# EAGLE design Rev A (EAGLE 9.6.2)
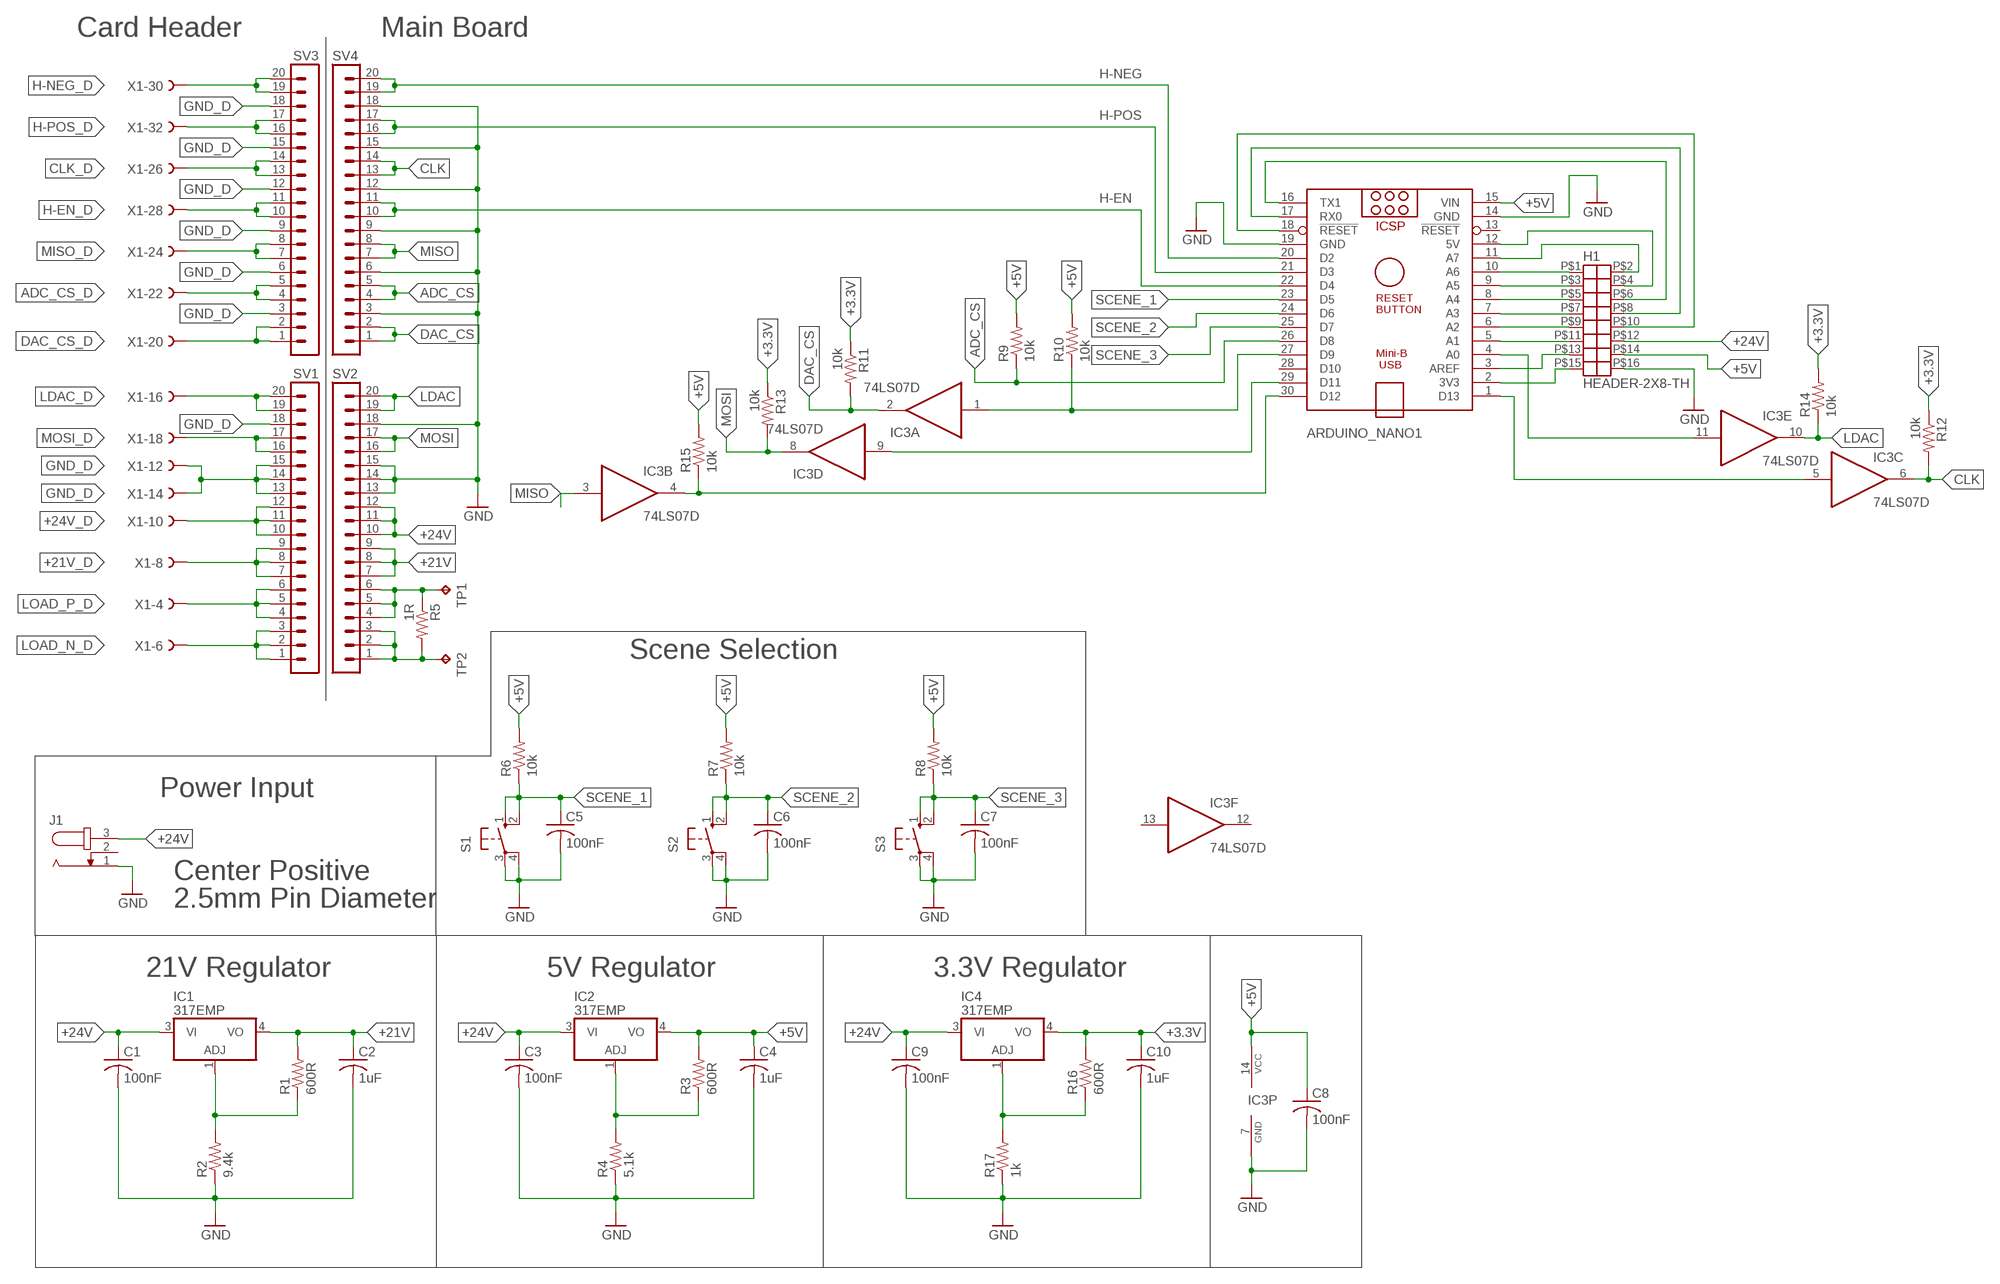
[diagram p0: schematic, sheet 1]

## Parts
ARDUINO_NANO1  ARDUINO_NANO  [ARDUINO_NANO]
C1  100nF  C-USC0603  [C0603]
C2  1uF  C-USC1206  [C1206]
C3  100nF  C-USC0603  [C0603]
C4  1uF  C-USC1206  [C1206]
C5  100nF  C-USC0603  [C0603]
C6  100nF  C-USC0603  [C0603]
C7  100nF  C-USC0603  [C0603]
C8  100nF  C-USC0603  [C0603]
C9  100nF  C-USC0603  [C0603]
C10  1uF  C-USC1206  [C1206]
H1  HEADER-2X8-TH  [HEADER-2X8-TH]
IC1  317EMP  [SOT223]
IC2  317EMP  [SOT223]
IC3  74LS07D  [SO14]
IC4  317EMP  [SOT223]
J1  JACK-PLUG1  [SPC4078]
R1  600R  R-US_R0603  [R0603]
R2  9.4k  R-US_R0603  [R0603]
R3  600R  R-US_R0603  [R0603]
R4  5.1k  R-US_R0603  [R0603]
R5  1R  R-US_R1206  [R1206]
R6  10k  R-US_R0603  [R0603]
R7  10k  R-US_R0603  [R0603]
R8  10k  R-US_R0603  [R0603]
R9  10k  R-US_R0603  [R0603]
R10  10k  R-US_R0603  [R0603]
R11  10k  R-US_R0603  [R0603]
R12  10k  R-US_R0603  [R0603]
R13  10k  R-US_R0603  [R0603]
R14  10k  R-US_R0603  [R0603]
R15  10k  R-US_R0603  [R0603]
R16  600R  R-US_R0603  [R0603]
R17  1k  R-US_R0603  [R0603]
S1  10-XX  [B3F-10XX]
S2  10-XX  [B3F-10XX]
S3  10-XX  [B3F-10XX]
SV1  MA20-1  [MA20-1]
SV2  MA20-1W  [MA20-1W]
SV3  MA20-1  [MA20-1]
SV4  MA20-1W  [MA20-1W]
TP1  TPB2,54  [B2,54]
TP2  TPB2,54  [B2,54]
X1  FH15  [FH15]

## Nets
+3.3V: C10.1 IC4.4(VO) R11.1 R12.1 R13.1 R14.2 R16.2
+5V: ARDUINO_NANO1.15(VIN) C4.1 C8.1 H1.P$14 IC2.4(VO) IC3.14(P:VCC) R3.2 R6.2 R7.2 R8.2 R9.2 R10.2 R15.2
+21V: C2.1 IC1.4(VO) R1.2 SV2.7 SV2.8 SV2.9
+21V_D: SV1.7 SV1.8 SV1.9 X1.8
+24V: C1.1 C3.1 C9.1 H1.P$12 IC1.3(VI) IC2.3(VI) IC4.3(VI) J1.3 SV2.10 SV2.11 SV2.12
+24V_D: SV1.10 SV1.11 SV1.12 X1.10
ADC_CS: ARDUINO_NANO1.26(D8) R9.1 SV4.4 SV4.5
ADC_CS_D: SV3.4 SV3.5 X1.22
CLK: IC3.6(C:O) R12.2 SV4.13 SV4.14
CLK_D: SV3.13 SV3.14 X1.26
DAC_CS: IC3.2(A:O) R11.2 SV4.1 SV4.2
DAC_CS_D: SV3.1 SV3.2 X1.20
GND: ARDUINO_NANO1.14(GND) ARDUINO_NANO1.19(GND) C1.2 C2.2 C3.2 C4.2 C5.2 C6.2 C7.2 C8.2 C9.2 C10.2 H1.P$16 IC3.7(P:GND) J1.1 R2.1 R4.1 R17.1 S1.3(P) S1.4(P1) S2.3(P) S2.4(P1) S3.3(P) S3.4(P1) SV2.13 SV2.14 SV2.15 SV2.18 SV4.3 SV4.6 SV4.9 SV4.12 SV4.15 SV4.18
GND_D: SV1.13 SV1.14 SV1.15 SV1.18 SV3.3 SV3.6 SV3.9 SV3.12 SV3.15 SV3.18 X1.12 X1.14
H-EN_D: SV3.10 SV3.11 X1.28
H-NEG_D: SV3.19 SV3.20 X1.30
H-POS_D: SV3.16 SV3.17 X1.32
LDAC: IC3.10(E:O) R14.1 SV2.19 SV2.20
LDAC_D: SV1.19 SV1.20 X1.16
LOAD_N_D: SV1.1 SV1.2 SV1.3 X1.6
LOAD_P_D: SV1.4 SV1.5 SV1.6 X1.4
MISO: IC3.3(B:I) SV4.7 SV4.8
MISO_D: SV3.7 SV3.8 X1.24
MOSI: IC3.8(D:O) R13.2 SV2.16 SV2.17
MOSI_D: SV1.16 SV1.17 X1.18
N$1: IC2.1(ADJ) R3.1 R4.2
N$2: IC1.1(ADJ) R1.1 R2.2
N$3: ARDUINO_NANO1.20(D2) SV4.19 SV4.20
N$4: ARDUINO_NANO1.2(3V3) H1.P$15
N$5: ARDUINO_NANO1.21(D3) SV4.16 SV4.17
N$6: ARDUINO_NANO1.3(AREF) H1.P$13
N$7: ARDUINO_NANO1.5(A1) H1.P$11
N$8: ARDUINO_NANO1.6(A2) H1.P$9
N$9: ARDUINO_NANO1.22(D4) SV4.10 SV4.11
N$10: ARDUINO_NANO1.7(A3) H1.P$7
N$11: ARDUINO_NANO1.8(A4) H1.P$5
N$12: ARDUINO_NANO1.9(A5) H1.P$3
N$13: ARDUINO_NANO1.10(A6) H1.P$1
N$14: ARDUINO_NANO1.11(A7) H1.P$2
N$15: ARDUINO_NANO1.12(5V) H1.P$4
N$16: ARDUINO_NANO1.16(TX1) H1.P$6
N$17: ARDUINO_NANO1.17(RX0) H1.P$8
N$18: ARDUINO_NANO1.18(!RESET) H1.P$10
N$19: ARDUINO_NANO1.27(D9) IC3.1(A:I) R10.1
N$20: ARDUINO_NANO1.1(D13) IC3.5(C:I)
N$21: ARDUINO_NANO1.29(D11) IC3.9(D:I)
N$22: R5.1 SV2.4 SV2.5 SV2.6 TP1.TP
N$23: R5.2 SV2.1 SV2.2 SV2.3 TP2.TP
N$24: ARDUINO_NANO1.4(A0) IC3.11(E:I)
N$25: ARDUINO_NANO1.30(D12) IC3.4(B:O) R15.1
N$26: IC4.1(ADJ) R16.1 R17.2
SCENE_1: ARDUINO_NANO1.23(D5) C5.1 R6.1 S1.1(S) S1.2(S1)
SCENE_2: ARDUINO_NANO1.24(D6) C6.1 R7.1 S2.1(S) S2.2(S1)
SCENE_3: ARDUINO_NANO1.25(D7) C7.1 R8.1 S3.1(S) S3.2(S1)
Unconnected: ARDUINO_NANO1.13(!RESET) ARDUINO_NANO1.28(D10) IC3.12(F:O) IC3.13(F:I) J1.2

## Notes on the sheet
- Card Header | Main Board
- H-NEG
- H-POS
- H-EN
- Scene Selection
- Power Input
- Center Positive
- 2.5mm Pin Diameter
- 21V Regulator | 5V Regulator | 3.3V Regulator

## Library data of the parts
ARDUINO_NANO1 = ArduinoNanoV30:ARDUINO_NANO: Arduino Nano V3.0 Overview: The Arduino Nano is a small, complete, and breadboard-friendly board based on the ATmega328 (Arduino Nano 3.x) or ATmega168 (Arduino Nano 2.x). It has more or less the same functionality of the Arduino Duemilanove, but in a different package. It lacks only a DC power jack, and works with a Mini-B USB cable instead of a standard one. The Nano was designed and is being produced by Gravitech. Specifications: Microcontroller Atmel ATmega168 or ATmega328 Operating Voltage (logic level) 5 V Input Voltage (recommended) 7-12 V Input Voltage (limits) 6-20 V Digital I/O Pins 14 (of which 6 provide PWM output) Analog Input Pins 8 DC Current per I/O Pin 40 mA Flash Memory 16 KB (ATmega168) or 32 KB (ATmega328) of which 2 KB used by bootloader SRAM 1 KB (ATmega168) or 2 KB (ATmega328) EEPROM 512 bytes (ATmega168) or 1 KB (ATmega328) Clock Speed 16 MHz Dimensions 0.73" x 1.70" Length 45 mm Width 18 mm Weigth 5 g Power: The Arduino Nano can be powered via the Mini-B USB connection, 6-20V unregulated external power supply (pin 30), or 5V regulated external power supply (pin 27). The power source is automatically selected to the highest voltage source. Memory: The ATmega168 has 16 KB of flash memory for storing code (of which 2 KB is used for the bootloader); the ATmega328 has 32 KB, (also with 2 KB used for the bootloader). The ATmega168 has 1 KB of SRAM and 512 bytes of EEPROM (which can be read and written with the EEPROM library); the ATmega328 has 2 KB of SRAM and 1 KB of EEPROM. Input and Output: Each of the 14 digital pins on the Nano can be used as an input or output, using pinMode(), digitalWrite(), and digitalRead() functions. They operate at 5 volts. Each pin can provide or receive a maximum of 40 mA and has an internal pull-up resistor (disconnected by default) of 20-50 kOhms. In addition, some pins have specialized functions. Visit Arduino - ArduinoBoardNano <https://www.arduino.cc/en/Main/ArduinoBoardNano>
C1-C10 = MMIModular Parts:C-US: CAPACITOR, American symbol; SPICEPREFIX: C
H1 = 4ms-main-parts:HEADER-2X8: SMT HEADER 2x8 Unshrouded: Cixi Langling LL1010-5C (HI TEMP 2*8PIN) Shrouded: Cixi Langling LL1007-3 (2*8PIN)
IC1 IC2 IC4 = linear:*317: Positive VOLTAGE REGULATOR
IC3 = 74xx-us:74*07: Hex BUFFER, open collector high-voltage output
J1 = con-jack:JACK-PLUG: DC POWER JACK Power Jack, DC, Right Angle, Through Hole, Rated 5A at 16VDC, PC Terminals Distributor: Farnell (www.Farnell.de) Drawing: 84N1161.pdf / 84N1162.pdf Manufacturer: SPC Technology (www.spctechnology.com) Type: SPC4077 / SPC 4078; OC_FARNELL: unknown; OC_NEWARK: unknown
R1-R17 = MMIModular Parts:R-US_: RESISTOR, American symbol; SPICEPREFIX: R
S1-S3 = switch-omron:10-XX: OMRON SWITCH; MPN: B3F-1000; OC_FARNELL: 176432; OC_NEWARK: 36M3542
SV1 SV3 = con-lstb:MA20-1: PIN HEADER; OC_FARNELL: unknown; OC_NEWARK: unknown
SV2 SV4 = con-lstb:MA20-1W: PIN HEADER; OC_FARNELL: unknown; OC_NEWARK: unknown
TP1 TP2 = testpad:TP: Test pad
X1 = con-vg:FH15: CONNECTOR female, 15 pins, type H, rows DZ

## Board
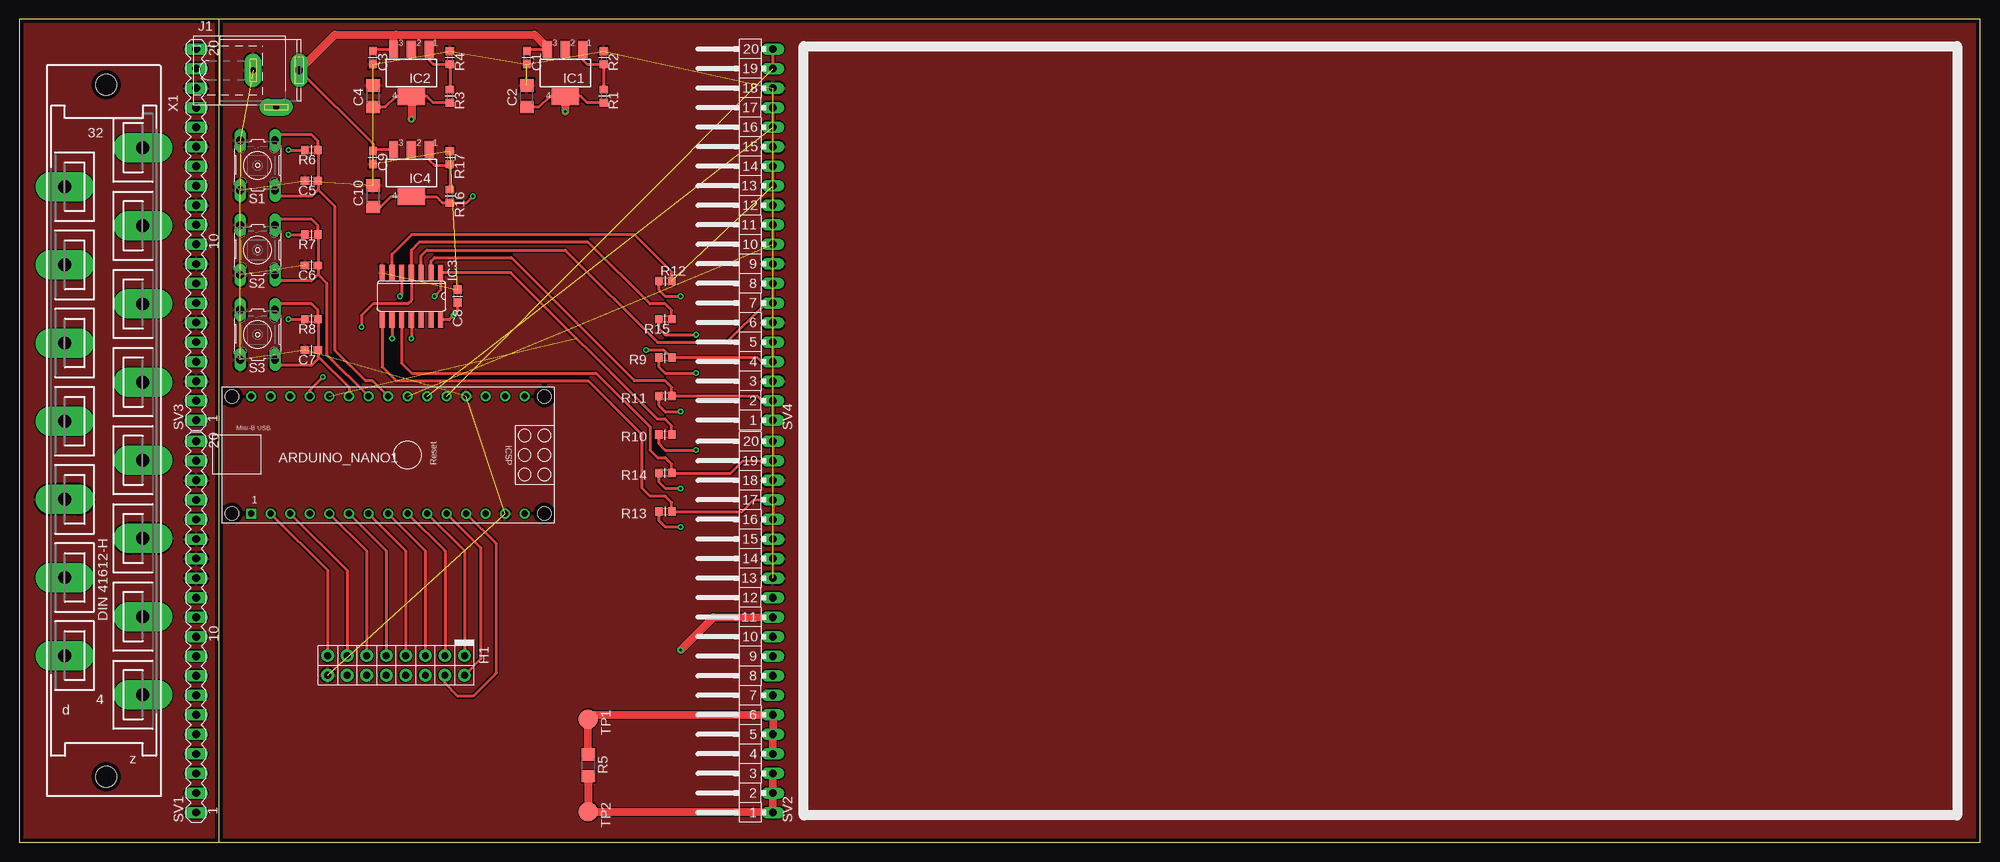
[diagram p1: board, top side]
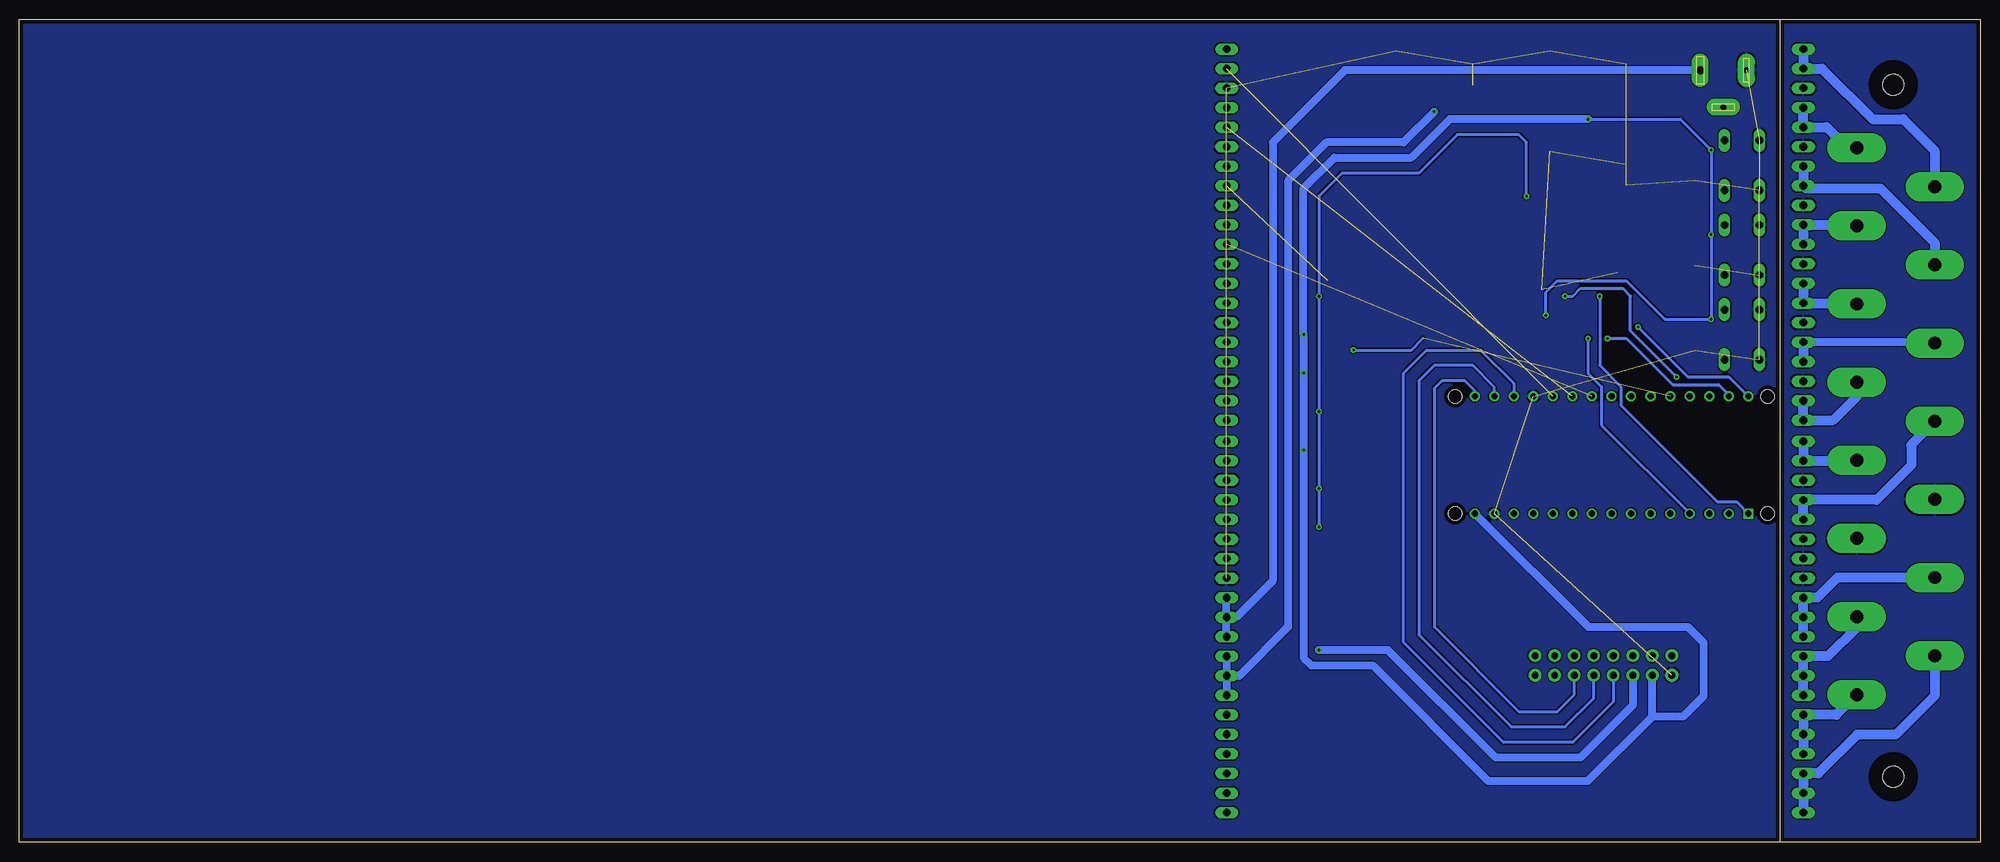
[diagram p2: board, bottom side, seen from below]

Size 255 x 107 mm. Coordinates in mm from the lower left corner, seen from the top.
Outline: 26,0 0,0 0,107 26,107
Outline: 26,0 255,0 255,107 26,107
Outline: 26,0 26,107
Copper layers (1*16): Top 0.035mm / dielectric 1.5mm / Bottom 0.035mm
Design rules "default *": minimum track width 6mil, minimum drill 0.35mm, track to track 6mil, track to pad 6mil, pad to pad 6mil, via to via 6mil, smd to smd 6mil, copper to edge 20mil, drill to drill 6mil, minimum pad ring 10mil, minimum via ring 8mil, stop-mask expansion 4mil, vias tented up to drill 0mil, thermal gap 10mil

### Footprints (pad centres in the part's own frame; a part is rotated, then mirrored left to right if it is on the bottom)
ARDUINO_NANO = drill 0.8 square: 1 -20.32,-7.62 | drill 0.8: 2 -17.78,-7.62; 3 -15.24,-7.62; 4 -12.7,-7.62; 5 -10.16,-7.62; 6 -7.62,-7.62; 7 -5.08,-7.62; 8 -2.54,-7.62; 9 0,-7.62; 10 2.54,-7.62; 11 5.08,-7.62; 12 7.62,-7.62; 13 10.16,-7.62; 14 12.7,-7.62; 15 15.24,-7.62; 16 15.24,7.62; 17 12.7,7.62; 18 10.16,7.62; 19 7.62,7.62; 20 5.08,7.62; 21 2.54,7.62; 22 0,7.62; 23 -2.54,7.62; 24 -5.08,7.62; 25 -7.62,7.62; 26 -10.16,7.62; 27 -12.7,7.62; 28 -15.24,7.62; 29 -17.78,7.62; 30 -20.32,7.62 | hole 1.778: -22.86,-7.62; -22.86,7.62; 17.78,7.62; 17.78,-7.62
C0603 = smd 1.1 x 1: 1 -0.85,0; 2 0.85,0
C1206 = smd 1.6 x 1.8: 1 -1.4,0; 2 1.4,0
HEADER-2X8-TH = drill 0.9 pad 1.651: P$1 -1.27,8.89; P$2 1.27,8.89; P$3 -1.27,6.35; P$4 1.27,6.35; P$5 -1.27,3.81; P$6 1.27,3.81; P$7 -1.27,1.27; P$8 1.27,1.27; P$9 -1.27,-1.27; P$10 1.27,-1.27; P$11 -1.27,-3.81; P$12 1.27,-3.81; P$13 -1.27,-6.35; P$14 1.27,-6.35; P$15 -1.27,-8.89; P$16 1.27,-8.89
SOT223 = smd 1.219 x 2.235: 1 -2.311,-3.099; 2 0,-3.099; 3 2.311,-3.099 | smd 3.6 x 2.2: 4 0,3.099
SO14 = smd 0.66 x 2.032: 1 -3.81,-3.073; 2 -2.54,-3.073; 3 -1.27,-3.073; 4 0,-3.073; 5 1.27,-3.073; 6 2.54,-3.073; 7 3.81,-3.073; 8 3.81,3.073; 9 2.54,3.073; 10 1.27,3.073; 11 0,3.073; 12 -1.27,3.073; 13 -2.54,3.073; 14 -3.81,3.073
SPC4078 = drill 0.8 pad 2.184 long: 1 -3,0; 2 0,-4.8 | drill 1 pad 2.184 long: 3 3,0
R0603 = smd 1 x 1.1: 1 -0.85,0; 2 0.85,0
R1206 = smd 1.6 x 1.803: 1 -1.422,0; 2 1.422,0
B3F-10XX = drill 1.016 long: 1 -3.251,2.261; 2 3.251,2.261; 3 -3.251,-2.261; 4 3.251,-2.261
MA20-1 = drill 1.016 long: 1 -24.13,0; 2 -21.59,0; 3 -19.05,0; 4 -16.51,0; 5 -13.97,0; 6 -11.43,0; 7 -8.89,0; 8 -6.35,0; 9 -3.81,0; 10 -1.27,0; 11 1.27,0; 12 3.81,0; 13 6.35,0; 14 8.89,0; 15 11.43,0; 16 13.97,0; 17 16.51,0; 18 19.05,0; 19 21.59,0; 20 24.13,0
MA20-1W = drill 1.016 long: 1 -24.13,0; 2 -21.59,0; 3 -19.05,0; 4 -16.51,0; 5 -13.97,0; 6 -11.43,0; 7 -8.89,0; 8 -6.35,0; 9 -3.81,0; 10 -1.27,0; 11 1.27,0; 12 3.81,0; 13 6.35,0; 14 8.89,0; 15 11.43,0; 16 13.97,0; 17 16.51,0; 18 19.05,0; 19 21.59,0; 20 24.13,0
B2,54 = smd 2.54 x 2.54: TP 0,0
FH15 = drill 1.676 pad 3.81 long: 4 -5.08,34.315; 6 5.08,29.235; 8 -5.08,24.155; 10 5.08,19.075; 12 -5.08,13.995; 14 5.08,8.915; 16 -5.08,3.835; 18 5.08,-1.245; 20 -5.08,-6.325; 22 5.08,-11.405; 24 -5.08,-16.485; 26 5.08,-21.565; 28 -5.08,-26.645; 30 5.08,-31.725; 32 -5.08,-36.805 | hole 2.794: -0.305,44.983; -0.305,-44.983

### Placement (x,y rotation side)
ARDUINO_NANO1  50.49,50.36 0 top
C1  66,102 270 top
C2  66,97 90 top
C3  46,102 270 top
C4  46,97 90 top
C5  38,86 180 top
C6  38,75 180 top
C7  38,64 180 top
C8  57,71 90 top
C9  46,89 270 top
C10  46,84 90 top
H1  49,23 270 top
IC1  71,100 180 top
IC2  51,100 180 top
IC3  51,71 180 top
IC4  51,87 180 top
J1  33.41,100.38 0 top
R1  76,97 270 top
R2  76,102 270 top
R3  56,97 270 top
R4  56,102 270 top
R5  74,10 270 top
R6  38,90 180 top
R7  38,79 180 top
R8  38,68 180 top
R9  84,63 180 top
R10  84,53 180 top
R11  84,58 0 top
R12  84,73 0 top
R13  84,43 0 top
R14  84,48 180 top
R15  84,68 180 top
R16  56,84 270 top
R17  56,89 270 top
S1  31,88 270 top
S2  31,77 270 top
S3  31,66 270 top
SV1  23,28 90 top
SV2  98,28 90 top
SV3  23,79 90 top
SV4  98,79 90 top
TP1  74,16 270 top
TP2  74,4 270 top
X1  11,53.5 180 top

### Tracks (layer width: path | path; a pad name or v marks a point on that pad's centre or on a via)
+3.3V  (via drill 0.35)
  Top 0.406: C10.1 47,82.6 48.3,83.9 IC4.4 54.25,83.9 55,83.15 R16.2 58.15,83.15 v59,84 | R12.1 83.15,71.85 84,71 v86,71 | R11.1 83.15,56.85 84,56 v86,56 | R14.2 83.15,46.85 84,46 v86,46 | R13.1 83.15,41.85 84,41 v86,41
  Bottom 0.406: v59,84 59,91 60,92 68,92 73,87 83,87 86,84 v86,71 v86,56 v86,46 v86,41
+5V  (via drill 0.35)
  Top 0.406: C4.1 47.6,95.6 49,97 50.9,97 | 50.9,97 IC2.4 | R3.2 53.85,96.15 53,97 50.9,97 | v35,90 R6.2 | v35,79 R7.2 | v35,68 R8.2 | R15.2 83.15,66.85 84,66 v88,66 | R9.2 83.15,61.85 84,61 v88,61 | R10.2 83.15,51.85 84,51 v88,51 | IC3.14 55.93,67.93 v56.5,68.5 57,69 C8.1
  Top 1.016: IC2.4 v51,94
  Bottom 0.406: v51,94 39,94 v35,90 v35,79 v35,68 41,68 46,73 55,73 56.5,71.5 v56.5,68.5
  Bottom 1.016: v51,94 69,94 74,89 84,89 88,85 v88,66 v88,61 v88,51 88,24 87,23 79,23 64,8 51,8 42.65,16.35 | 42.65,16.35 H1.P$14 | ARDUINO_NANO1.15 50.99,28 38,28 36,26 36,19 38.65,16.35 42.65,16.35
+21V  (via drill 0.35)
  Top 0.406: C2.1 67.6,95.6 69,97 70.9,97 IC1.4 71.1,97 73,97 73.85,96.15 R1.2
  Top 1.016: IC1.4 v71,95
  Bottom 1.016: v71,95 75,91 85,91 90,86 90,28 96.35,21.65 SV2.8 | SV2.9 SV2.8 | SV2.8 SV2.7
+21V_D
  Bottom 1.27: SV1.7 SV1.8 SV1.9 19.81,24.19 16.08,27.92 X1.8
+24V  (via drill 0.35)
  Top 0.406: C3.1 46.25,103.1 IC2.3 | C1.1 66.25,103.1 IC1.3 | IC4.3 46.25,90.1 C9.1 46,90.79 J1.3
  Top 1.016: J1.3 41.03,105 49,105 | IC1.3 68.69,103.31 67,105 49,105 | IC2.3 48.69,104.69 49,105 | v86,25 90.27,29.27 SV2.11
  Bottom 1.016: J1.3 82.62,100.38 92,91 92,34 96.73,29.27 SV2.11 | SV2.11 SV2.12 | SV2.10 SV2.11 | H1.P$12 45.19,17.81 52,11 63,11 77,25 v86,25
+24V_D
  Bottom 1.27: SV1.10 SV1.11 SV1.12 21.19,31.81 18.57,34.42 X1.10
ADC_CS  (via drill 0.35)  (1 unrouted)
  Top 0.406: SV4.5 SV4.4 96.51,62.49 96,63 R9.1 83.85,64 v81.5,64
  Bottom 0.406: v81.5,64 74,64 72.5,65.5
ADC_CS_D
  Bottom 1.016: X1.22 6.04,65.03 SV3.5
  Bottom 1.27: SV3.5 SV3.4
CLK  (1 unrouted)
  Top 0.406: SV4.13 SV4.14 | IC3.6 48.46,76.46 51,79 80,79 84.85,74.15 R12.2
CLK_D
  Bottom 1.27: SV3.14 SV3.13 22.65,85 13,85 5.92,77.92 X1.26
DAC_CS
  Top 0.406: SV4.1 SV4.2 96.59,57.41 96,58 R11.2 84.85,59.15 84,60 80,60 64,76 54,76 53.54,75.54 IC3.2
DAC_CS_D
  Bottom 1.27: SV3.2 SV3.1 19.13,54.87 16.08,57.92 X1.20
GND  (33 unrouted)
  pour Top: 26,109 26,-4 258,-4 258,109
  pour Bottom: 26,111 26,-2 259,-2 259,111
GND_D
  pour Top: -1,-1 26,-1 26,107 -1,107
  pour Bottom: -2,-1 26,-1 26,108 -2,108
H-EN_D
  Bottom 1.27: SV3.10 SV3.11 16.2,80.27 X1.28
H-NEG_D
  Bottom 1.27: SV3.20 SV3.19 20.59,100.59 14,94 10,94 5.92,89.92 X1.30
H-POS_D
  Bottom 1.27: SV3.17 SV3.16 19.97,92.97 17.3,90.31 X1.32
LDAC
  Top 0.406: SV2.20 SV2.19 94.09,49.59 92.5,48 R14.1 84.85,49.15 84,50 83,50 82,51 82,54 75,61 51,61 49.73,62.27 IC3.10
LDAC_D
  Bottom 1.27: SV1.20 SV1.19 16.16,49.59 X1.16
LOAD_N_D
  Bottom 1.27: X1.6 5.92,19.08 11,14 16,14 21.05,8.95 SV1.3 SV1.2 SV1.1
LOAD_P_D
  Bottom 1.27: X1.4 18.7,16.57 SV1.6 SV1.5 SV1.4
MISO
  Top 0.406: SV4.8 SV4.7 97.11,70.11 92,65 83,65 71,77 53,77 52.27,76.27 IC3.3
MISO_D
  Bottom 1.27: SV3.8 SV3.7 16.2,70.11 X1.24
MOSI
  Top 0.406: SV2.16 SV2.17 95.51,44.51 94,43 R13.2 84.85,44.15 84,45 82,45 81,46 81,53 74,60 49,60 47.19,61.81 IC3.8
MOSI_D
  Bottom 1.27: SV1.16 SV1.17 13.49,44.51 9,49 9,51.66 X1.18
N$1
  Top 0.406: IC2.1 53.31,101.69 53.85,101.15 R4.2 R3.1
N$2
  Top 0.406: R1.1 R2.2 73.85,101.15 73.31,101.69 IC1.1
N$3  (1 unrouted)
  Top 0.406: SV4.19 SV4.20
N$4
  Top 0.406: ARDUINO_NANO1.2 40.11,35.34 H1.P$15
N$5  (1 unrouted)
  Top 0.406: SV4.16 SV4.17
N$6
  Top 0.406: ARDUINO_NANO1.3 42.65,35.34 H1.P$13
N$7
  Top 0.406: ARDUINO_NANO1.5 45.19,37.88 H1.P$11
N$8
  Top 0.406: ARDUINO_NANO1.6 47.73,37.88 H1.P$9
N$9  (1 unrouted)
  Top 0.406: SV4.10 SV4.11
N$10
  Top 0.406: ARDUINO_NANO1.7 50.27,37.88 H1.P$7
N$11
  Top 0.406: ARDUINO_NANO1.8 52.81,37.88 H1.P$5
N$12
  Top 0.406: ARDUINO_NANO1.9 55.35,37.88 H1.P$3
N$13
  Top 0.406: ARDUINO_NANO1.10 57.89,37.88 H1.P$1
N$14
  Top 0.406: ARDUINO_NANO1.11 60,38.31 60,23.84 H1.P$2
N$15
  Top 0.406: ARDUINO_NANO1.12 62,38.85 62,22 59,19 57,19 55.35,20.65 H1.P$4
N$16
  Bottom 0.406: ARDUINO_NANO1.16 65.73,58.73 67,60 70,60 71,59 71,28 60,17 55,17 52.81,19.19 H1.P$6
N$17
  Bottom 0.406: ARDUINO_NANO1.17 63.19,59.19 66,62 71,62 73,60 73,27 61,15 54,15 50.27,18.73 H1.P$8
N$18
  Bottom 0.406: H1.P$10 47.73,18.27 53,13 62,13 75,26 75,61 72,64 65,64 60.65,59.65 ARDUINO_NANO1.18
N$19  (via drill 0.35)
  Top 0.406: R10.1 84.85,54.15 84,55 83,55 63.93,74.07 IC3.1 54.81,71.81 v54,71 | ARDUINO_NANO1.27 37.79,58.79 v39.5,60.5
  Bottom 0.406: v39.5,60.5 45.5,66.5 45.5,71 46.5,72 52,72 53,71 v54,71
N$20  (via drill 0.35)
  Top 0.406: IC3.5 49.73,71.23 v49.5,71
  Bottom 0.406: v49.5,71 49.5,62 46.75,59.25 46.75,56.82 34.17,44.24 31.67,44.24 ARDUINO_NANO1.1
N$21  (via drill 0.35)
  Top 0.406: IC3.9 48.46,65.54 v48.5,65.5
  Bottom 0.406: v48.5,65.5 46,65.5 40,59.5 34,59.5 32.71,58.21 ARDUINO_NANO1.29
N$22
  Top 1.016: R5.1 TP1.TP 74.57,16.57 SV2.6 SV2.5 SV2.4
N$23
  Top 1.016: R5.2 TP2.TP 97.87,4 SV2.1 SV2.2 SV2.3
N$24  (via drill 0.35)
  Top 0.406: IC3.11 v51,65.5
  Bottom 0.406: v51,65.5 51,61 49.25,59.25 49.25,54.25 37.79,42.79 ARDUINO_NANO1.4
N$25  (via drill 0.35)
  Top 0.406: R15.1 84.85,69.15 84,70 82,70 74,78 52,78 51,77 IC3.4 51,70.5 50.5,70 46,70 44.5,68.5 v44.5,67
  Bottom 0.406: ARDUINO_NANO1.30 32.69,60.5 38,60.5 v44.5,67
N$26
  Top 0.406: R16.1 R17.2 55.85,88 54,88 53.31,88.69 IC4.1
SCENE_1
  Top 0.406: ARDUINO_NANO1.23 45.95,59.98 45.02,59.98 41,64 41,82.7 38.85,84.85 | S1.1 34.01,92 38,92 38.85,91.15 R6.1 C5.1 38.85,84.85 | 38.85,84.85 38,84 34.01,84 S1.2
SCENE_2
  Top 0.406: S2.1 34.01,81 38,81 38.85,80.15 R7.1 C6.1 38.85,73.85 | 38.85,73.85 38,73 34.01,73 S2.2 | 38.85,73.85 40,72.7 40,63.39 ARDUINO_NANO1.24
SCENE_3
  Top 0.406: 38.85,63.15 C7.1 R8.1 38.85,69.15 38,70 34.01,70 S3.1 | 38.85,63.15 38.85,62.85 38,62 34.01,62 S3.2 | 38.85,63.15 42.87,59.13 ARDUINO_NANO1.25